# EAGLE design LED Sticks (EAGLE 6.4)
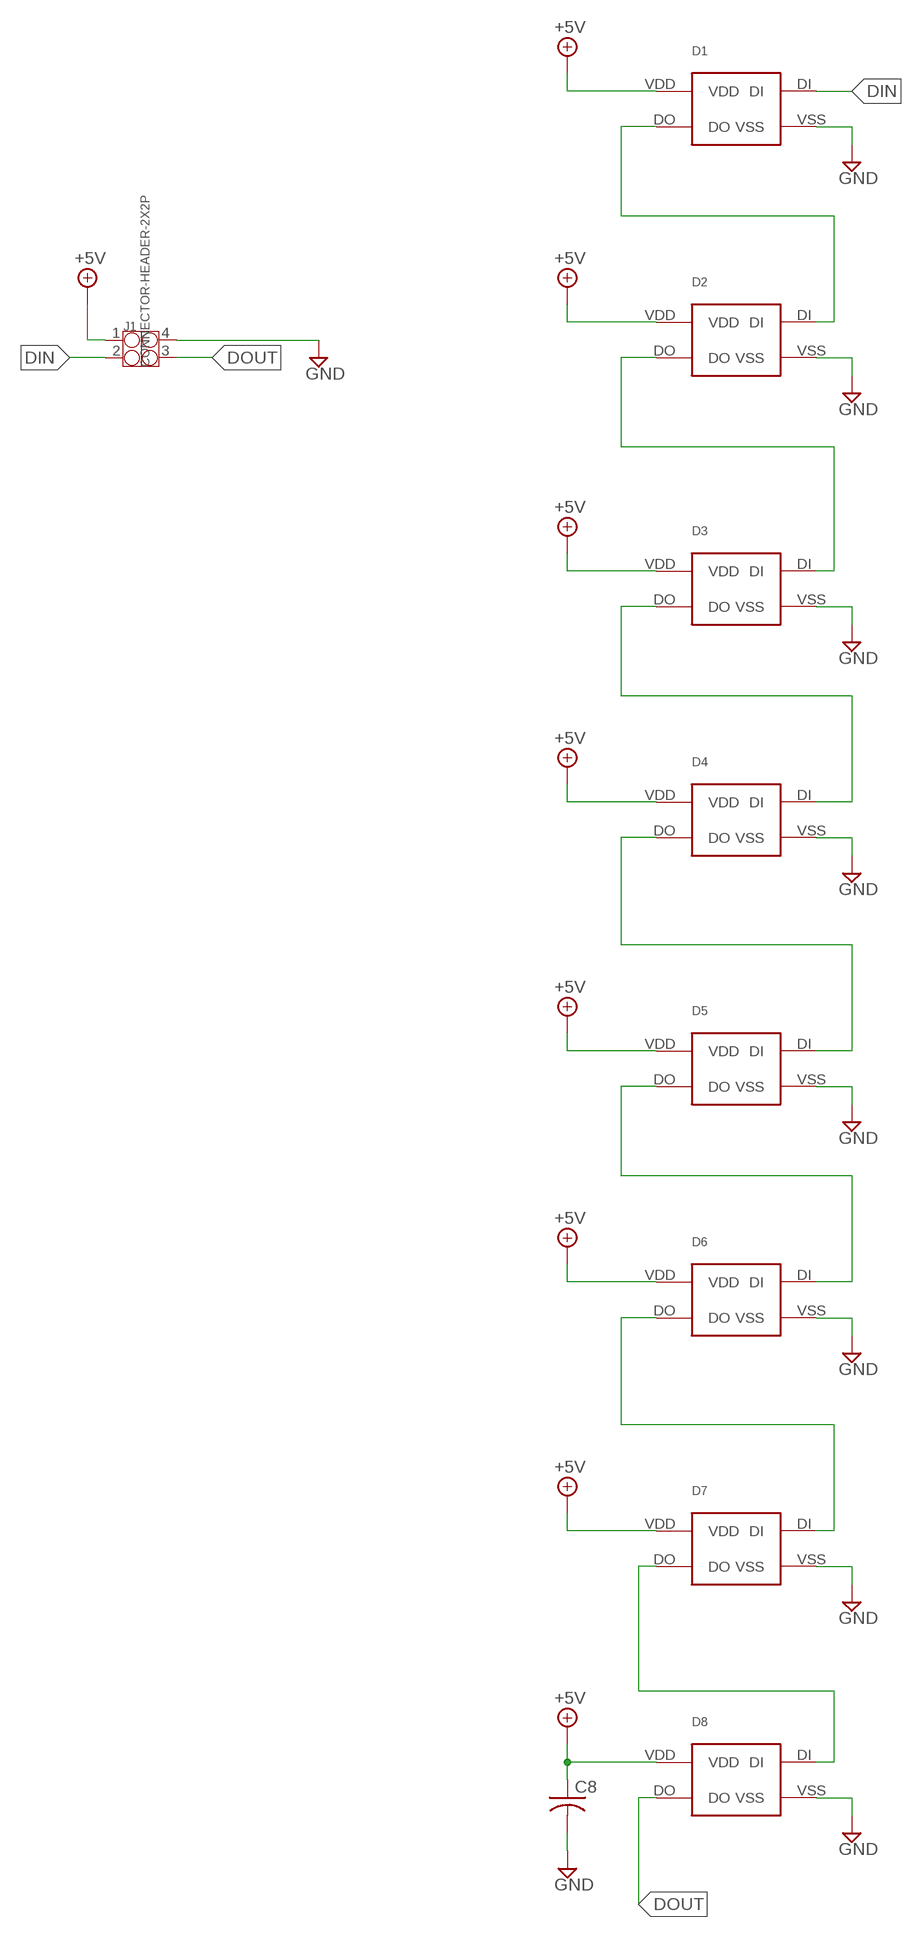
[diagram p0: schematic, sheet 1]

## Parts
C8  C-USC0603K  [C0603K]
D1  WS2812B  [WS2812B]
D2  WS2812B  [WS2812B]
D3  WS2812B  [WS2812B]
D4  WS2812B  [WS2812B]
D5  WS2812B  [WS2812B]
D6  WS2812B  [WS2812B]
D7  WS2812B  [WS2812B]
D8  WS2812B  [WS2812B]
J1  CONNECTOR-HEADER-2X2P  [2X2P-2.54]

## Nets
+5V: C8.1 D1.VDD D2.VDD D3.VDD D4.VDD D5.VDD D6.VDD D7.VDD D8.VDD J1.1
DIN: D1.DI J1.2
DOUT: D8.DO J1.3
GND: C8.2 D1.VSS D2.VSS D3.VSS D4.VSS D5.VSS D6.VSS D7.VSS D8.VSS J1.4
N$1: D1.DO D2.DI
N$2: D2.DO D3.DI
N$3: D3.DO D4.DI
N$4: D4.DO D5.DI
N$5: D5.DO D6.DI
N$6: D6.DO D7.DI
N$7: D7.DO D8.DI

## Library data of the parts
C8 = resistor:C-US: CAPACITOR, American symbol
D1-D8 = lumex:WS2812B
J1 = OPL Eagle Library:CONNECTOR-HEADER-2X2P

## Board
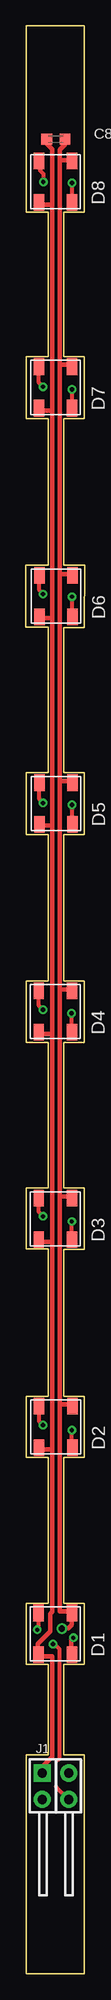
[diagram p1: board, top side]
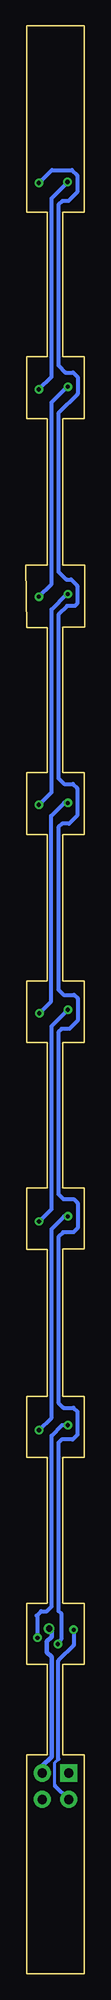
[diagram p2: board, bottom side, seen from below]

Size 5.68 x 187.51 mm. Coordinates in mm from the lower left corner, seen from the top.
Outline: 0.05,187.51 5.62,187.51 5.62,169.57 3.65,169.57 3.65,155.65 5.62,155.65 5.62,149.71 3.65,149.71 3.65,135.58 5.68,135.58 5.62,129.59 3.65,129.59 3.65,115.62 5.62,115.62 5.62,109.67 3.65,109.67 3.65,95.55 5.62,95.55 5.62,89.66 3.65,89.66 3.65,75.64 5.62,75.64 5.62,69.7 3.65,69.7 3.65,55.57 5.62,55.57 5.62,49.68 3.65,49.68 3.65,35.66 5.62,35.66 5.62,29.77 3.65,29.77 3.65,21.08 5.62,21.08 5.62,0 0.05,0 0.05,21.08 2.13,21.08 2.13,29.77 0.05,29.77 0.05,35.66 2.13,35.66 2.13,49.68 0.05,49.68 0.05,55.57 2.13,55.57 2.13,69.75 0.05,69.75 0.05,75.64 2.13,75.64 2.13,89.66 0.05,89.66 0.05,95.55 2.13,95.55 2.13,109.67 0.05,109.67 0.05,115.62 2.13,115.62 2.13,129.64 0,129.64 0,135.58 2.13,135.58 2.13,149.71 0.05,149.71 0.05,155.65 2.13,155.65 2.13,169.57 0.05,169.57 0.05,187.51
Copper layers (1*16): Top 0.035mm / dielectric 1.5mm / Bottom 0.035mm
Design rules "default": minimum track width 10mil, minimum drill 24mil, track to track 8mil, track to pad 8mil, pad to pad 8mil, via to via 8mil, smd to smd 8mil, copper to edge 40mil, drill to drill 8mil, minimum pad ring 10mil, minimum via ring 8mil, stop-mask expansion 4mil, vias tented up to drill 0mil, thermal gap 10mil

### Footprints (pad centres in the part's own frame; a part is rotated, then mirrored left to right if it is on the bottom)
C0603K = smd 1.05 x 1.08: 1 -0.875,0; 2 0.875,0
WS2812B = smd 1.6 x 1: DI 4.2,0; DO 0.2,-3.2; VDD 0.2,0; VSS 4.2,-3.2
2X2P-2.54 = drill 0.889 pad 1.651 square: 1 -1.27,1.27 | drill 0.889 pad 1.651: 2 -1.27,-1.27; 3 1.27,-1.27; 4 1.27,1.27

### Placement (x,y rotation side)
C8  2.88,176.61 0 top
D1  1.21,30.52 90 top
D2  1.26,50.43 90 top
D3  1.23,70.46 90 top
D4  1.23,90.41 90 top
D5  1.28,110.46 90 top
D6  1.28,130.41 90 top
D7  1.25,150.51 90 top
D8  1.24,170.31 90 top
J1  2.84,18.03 0 top

### Tracks (layer width: path | path; a pad name or v marks a point on that pad's centre or on a via)
+5V
  Top 0.457: 2.53,50.44 2.53,70.43 | 2.53,70.43 2.53,90.45 | 2.53,90.45 2.53,110.51 | 2.53,110.51 2.53,130.48 | 2.53,130.48 2.53,150.49 | 2.53,150.49 2.53,170.28 | 2.53,170.28 2.53,175.66 2.01,176.19 C8.1 | D1.VDD 1.22,30.53 1.52,30.53 | D2.VDD 1.27,50.44 2.53,50.44 | D3.VDD 1.26,70.43 2.53,70.43 | D4.VDD 1.27,90.45 2.53,90.45 | D5.VDD 1.34,110.51 2.53,110.51 | D6.VDD 1.35,130.48 2.53,130.48 | D7.VDD 1.27,150.49 2.53,150.49 | D8.VDD 1.27,170.28 2.53,170.28 | J1.1 1.57,19.91 2.53,20.88 2.53,30.53 1.52,30.53 | 1.52,30.53 1.14,30.91 1.14,31.75 2.33,32.94 2.33,34.64 2.53,34.85 2.53,50.44
DIN  (via drill 0.41)
  Top 0.406: D1.DI 1.21,33.12 v1.08,33.09
  Bottom 0.305: 2.89,18.08 2.89,20.32 2.56,20.65
  Bottom 0.406: J1.2 2.89,18.08 | 2.56,20.65 2.56,30.15 1.08,31.62 v1.08,33.09
DOUT  (via drill 0.41)
  Top 0.305: 2.89,17.98 2.89,20.32 3.22,20.65
  Top 0.406: D8.DO 4.44,170.32 v4.44,172.39 | 2.89,17.98 J1.3 | 3.22,20.65 3.22,31.24 2.73,31.72 v2.61,31.72
  Bottom 0.406: v4.44,172.39 3.19,173.63 1.26,173.63 0.75,173.12 0.75,171.5 1.59,170.66 2.18,170.66 2.56,170.28 2.56,154.84 1.87,154.15 1.14,154.15 0.7,153.72 0.7,152.07 2.56,150.21 2.56,134.97 1.8,134.21 1.34,134.21 0.75,133.63 0.75,131.87 0.96,131.67 1.72,131.67 2.56,130.83 2.56,115.08 2,114.53 1.16,114.53 0.75,114.12 0.75,111.48 1.52,110.72 2.2,110.72 2.56,110.36 2.56,94.74 2.05,94.23 1.03,94.23 0.7,93.9 0.7,91.74 1.49,90.95 2.25,90.95 2.56,90.65 2.56,75.05 2.07,74.57 1.08,74.57 0.7,74.19 0.7,71.78 1.11,71.37 2.1,71.37 2.56,70.91 2.56,54.96 2.07,54.48 1.11,54.48 0.73,54.1 0.73,51.86 1.19,51.41 2.25,51.41 2.56,51.1 2.56,34.92 2.25,34.62 2.25,32.23 2.61,31.87 v2.61,31.72
GND  (via drill 0.6)
  Top 0.457: 3.24,54.79 3.24,34.87 4.36,34.87 D1.VSS 4.41,33.55 4.08,33.22 v3.45,33.22 | 3.24,54.79 3.24,74.8 | 3.24,74.8 3.24,94.76 | 3.24,94.76 3.24,114.83 | 3.24,114.83 3.24,134.74 | 3.24,134.74 3.24,154.91 | 3.24,154.91 3.24,174.6 | 3.24,174.6 3.24,175.61 3.76,176.13 C8.2 | D2.VSS 4.41,54.79 3.24,54.79 | D3.VSS 4.37,74.8 3.24,74.8 | D4.VSS 4.39,94.76 3.24,94.76 | D5.VSS 4.45,114.83 3.24,114.83 | D6.VSS 4.42,134.74 3.24,134.74 | D7.VSS 4.45,154.91 3.24,154.91 | D8.VSS 4.33,174.6 3.24,174.6
  Bottom 0.457: J1.4 4.11,19.99 3.22,20.88 3.22,30.48 3.68,30.93 3.68,31.98 3.22,32.43 3.22,32.99 v3.45,33.22
N$1  (via drill 0.41)
  Top 0.406: D1.DO 4.39,30.75 | v1.64,52.8 1.26,53.18 D2.DI
  Top 0.457: D1.DO 4.36,30.77 4.36,32.13 v4.56,32.33
  Bottom 0.406: v1.64,52.8 2.2,52.8 3.22,51.79 3.22,35.33 3.68,34.87 4.21,34.87 4.29,34.8 4.56,34.52 | 4.64,34.44 4.56,34.52 | v4.56,32.33 4.56,34.52
N$2  (via drill 0.41)
  Top 0.406: D2.DO 4.41,50.69 v4.41,52.32 | v1.64,72.9 1.23,73.3 D3.DI
  Bottom 0.406: v4.41,52.32 3.22,53.52 3.22,71.68 2,72.9 v1.64,72.9
N$3  (via drill 0.41)
  Top 0.406: D3.DO 4.41,70.48 v4.41,72.41 | v1.64,92.78 1.23,93.19 D4.DI
  Bottom 0.406: v4.41,72.41 3.22,73.61 3.22,91.21 v1.64,92.78
N$4  (via drill 0.41)
  Top 0.406: D4.DO 4.39,90.46 v4.39,92.45 | v1.64,112.7 1.28,113.06 D5.DI
  Bottom 0.406: v4.39,92.45 3.24,93.6 3.24,111.45 2,112.7 v1.64,112.7
N$5  (via drill 0.41)
  Top 0.406: D5.DO 4.44,110.51 v4.44,112.52 | v1.64,132.81 1.28,133.17 D6.DI
  Bottom 0.406: v4.44,112.52 3.22,113.74 3.22,131.34 1.74,132.81 v1.64,132.81
N$6  (via drill 0.41)
  Top 0.406: D6.DO 4.44,130.46 v4.44,132.56 | v1.64,152.78 1.24,153.18 D7.DI
  Bottom 0.406: v4.44,132.56 3.22,133.78 3.22,151.28 1.72,152.78 v1.64,152.78
N$7  (via drill 0.41)
  Top 0.406: D7.DO 4.44,150.52 v4.44,152.52 | D8.DI 1.36,174.59 1.36,173.58 1.67,173.28 v1.67,172.49
  Bottom 0.406: v4.44,152.52 3.22,153.74 3.22,170.91 1.67,172.46 v1.67,172.49 1.59,172.54